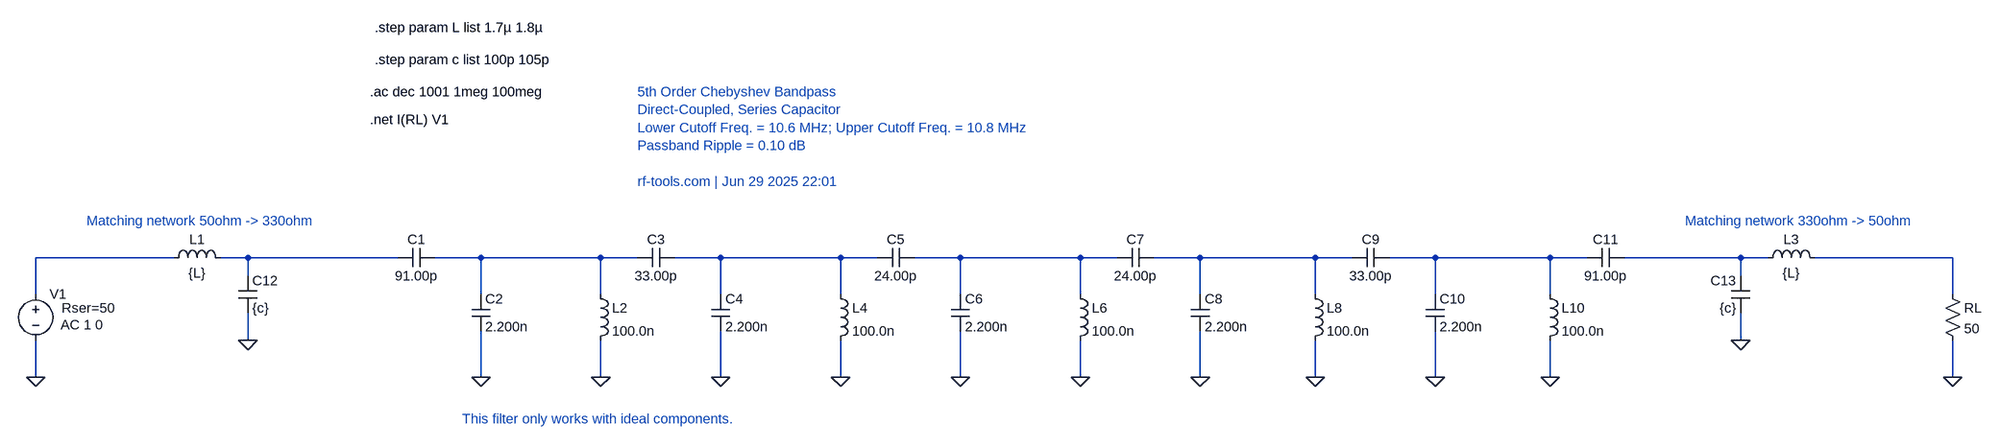
[diagram p0: schematic filter_markiMicrowave.asc]
filter_markiMicrowave.asc, the LTspice schematic file:
Version 4
SHEET 1 3188 400
WIRE -496 0 -736 0
WIRE -368 0 -416 0
WIRE 64 0 -368 0
WIRE 208 0 128 0
WIRE 416 0 208 0
WIRE 480 0 416 0
WIRE 624 0 544 0
WIRE 832 0 624 0
WIRE 896 0 832 0
WIRE 1040 0 960 0
WIRE 1248 0 1040 0
WIRE 1312 0 1248 0
WIRE 1456 0 1376 0
WIRE 1664 0 1456 0
WIRE 1728 0 1664 0
WIRE 1872 0 1792 0
WIRE 2080 0 1872 0
WIRE 2144 0 2080 0
WIRE 2752 0 2208 0
WIRE 2800 0 2752 0
WIRE 3120 0 2880 0
WIRE -368 32 -368 0
WIRE 2752 32 2752 0
WIRE -736 64 -736 0
WIRE 208 64 208 0
WIRE 416 64 416 0
WIRE 624 64 624 0
WIRE 832 64 832 0
WIRE 1040 64 1040 0
WIRE 1248 64 1248 0
WIRE 1456 64 1456 0
WIRE 1664 64 1664 0
WIRE 1872 64 1872 0
WIRE 2080 64 2080 0
WIRE 3120 64 3120 0
WIRE -368 144 -368 96
WIRE 2752 144 2752 96
WIRE -736 208 -736 144
WIRE 208 208 208 128
WIRE 416 208 416 144
WIRE 624 208 624 128
WIRE 832 208 832 144
WIRE 1040 208 1040 128
WIRE 1248 208 1248 144
WIRE 1456 208 1456 128
WIRE 1664 208 1664 144
WIRE 1872 208 1872 128
WIRE 2080 208 2080 144
WIRE 3120 208 3120 144
FLAG -736 208 0
FLAG 208 208 0
FLAG 416 208 0
FLAG 624 208 0
FLAG 832 208 0
FLAG 1040 208 0
FLAG 1248 208 0
FLAG 1456 208 0
FLAG 1664 208 0
FLAG 1872 208 0
FLAG 2080 208 0
FLAG 3120 208 0
FLAG -368 144 0
FLAG 2752 144 0
SYMBOL voltage -736 48 R0
WINDOW 123 43 69 Left 2
WINDOW 39 45 40 Left 2
SYMATTR Value2 AC 1 0
SYMATTR SpiceLine Rser=50
SYMATTR InstName V1
SYMATTR Value ""
SYMBOL cap 64 16 R270
WINDOW 0 32 32 VTop 2
WINDOW 3 0 32 VBottom 2
SYMATTR InstName C1
SYMATTR Value 91.00p
SYMBOL cap 192 64 R0
SYMATTR InstName C2
SYMATTR Value 2.200n
SYMBOL ind 400 48 R0
SYMATTR InstName L2
SYMATTR Value 100.0n
SYMBOL cap 480 16 R270
WINDOW 0 32 32 VTop 2
WINDOW 3 0 32 VBottom 2
SYMATTR InstName C3
SYMATTR Value 33.00p
SYMBOL cap 608 64 R0
SYMATTR InstName C4
SYMATTR Value 2.200n
SYMBOL ind 816 48 R0
SYMATTR InstName L4
SYMATTR Value 100.0n
SYMBOL cap 896 16 R270
WINDOW 0 32 32 VTop 2
WINDOW 3 0 32 VBottom 2
SYMATTR InstName C5
SYMATTR Value 24.00p
SYMBOL cap 1024 64 R0
SYMATTR InstName C6
SYMATTR Value 2.200n
SYMBOL ind 1232 48 R0
SYMATTR InstName L6
SYMATTR Value 100.0n
SYMBOL cap 1312 16 R270
WINDOW 0 32 32 VTop 2
WINDOW 3 0 32 VBottom 2
SYMATTR InstName C7
SYMATTR Value 24.00p
SYMBOL cap 1440 64 R0
SYMATTR InstName C8
SYMATTR Value 2.200n
SYMBOL ind 1648 48 R0
SYMATTR InstName L8
SYMATTR Value 100.0n
SYMBOL cap 1728 16 R270
WINDOW 0 32 32 VTop 2
WINDOW 3 0 32 VBottom 2
SYMATTR InstName C9
SYMATTR Value 33.00p
SYMBOL cap 1856 64 R0
SYMATTR InstName C10
SYMATTR Value 2.200n
SYMBOL ind 2064 48 R0
SYMATTR InstName L10
SYMATTR Value 100.0n
SYMBOL cap 2144 16 R270
WINDOW 0 32 32 VTop 2
WINDOW 3 0 32 VBottom 2
SYMATTR InstName C11
SYMATTR Value 91.00p
SYMBOL res 3104 48 R0
SYMATTR InstName RL
SYMATTR Value 50
SYMBOL ind -512 16 R270
WINDOW 0 32 56 VTop 2
WINDOW 3 5 56 VBottom 2
SYMATTR InstName L1
SYMATTR Value {L}
SYMBOL cap -384 32 R0
SYMATTR InstName C12
SYMATTR Value {c}
SYMBOL ind 2896 16 M270
WINDOW 0 32 56 VTop 2
WINDOW 3 5 56 VBottom 2
SYMATTR InstName L3
SYMATTR Value {L}
SYMBOL cap 2768 32 M0
SYMATTR InstName C13
SYMATTR Value {c}
TEXT 16 -288 Left 2 !.ac dec 1001 1meg 100meg
TEXT 16 -240 Left 2 !.net I(RL) V1
TEXT 480 -288 Left 2 ;5th Order Chebyshev Bandpass\nDirect-Coupled, Series Capacitor\nLower Cutoff Freq. = 10.6 MHz; Upper Cutoff Freq. = 10.8 MHz\nPassband Ripple = 0.10 dB\n\nrf-tools.com | Jun 29 2025 22:01
TEXT 176 280 Left 2 ;This filter only works with ideal components.
TEXT -648 -64 Left 2 ;Matching network 50ohm -> 330ohm
TEXT 2656 -64 Left 2 ;Matching network 330ohm -> 50ohm
TEXT 24 -344 Left 2 !.step param c list 100p 105p
TEXT 24 -400 Left 2 !.step param L list 1.7µ 1.8µ

The netlist it stands for:
* filter_markiMicrowave.asc
V1 N001 0 AC 1 0 Rser=50
C1 N002 N003 91.00p
C2 N003 0 2.200n
L2 N003 0 100.0n
C3 N003 N004 33.00p
C4 N004 0 2.200n
L4 N004 0 100.0n
C5 N004 N005 24.00p
C6 N005 0 2.200n
L6 N005 0 100.0n
C7 N005 N006 24.00p
C8 N006 0 2.200n
L8 N006 0 100.0n
C9 N006 N007 33.00p
C10 N007 0 2.200n
L10 N007 0 100.0n
C11 N007 N008 91.00p
RL N009 0 50
L1 N001 N002 {L}
C12 N002 0 {c}
L3 N009 N008 {L}
C13 N008 0 {c}
.ac dec 1001 1meg 100meg
.net I(RL) V1
* 5th Order Chebyshev Bandpass
* Direct-Coupled, Series Capacitor
* Lower Cutoff Freq. = 10.6 MHz; Upper Cutoff Freq. = 10.8 MHz
* Passband Ripple = 0.10 dB
* rf-tools.com | Jun 29 2025 22:01
* This filter only works with ideal components.
* Matching network 50ohm -> 330ohm
* Matching network 330ohm -> 50ohm
.step param c list 100p 105p
.step param L list 1.7µ 1.8µ
.backanno
.end